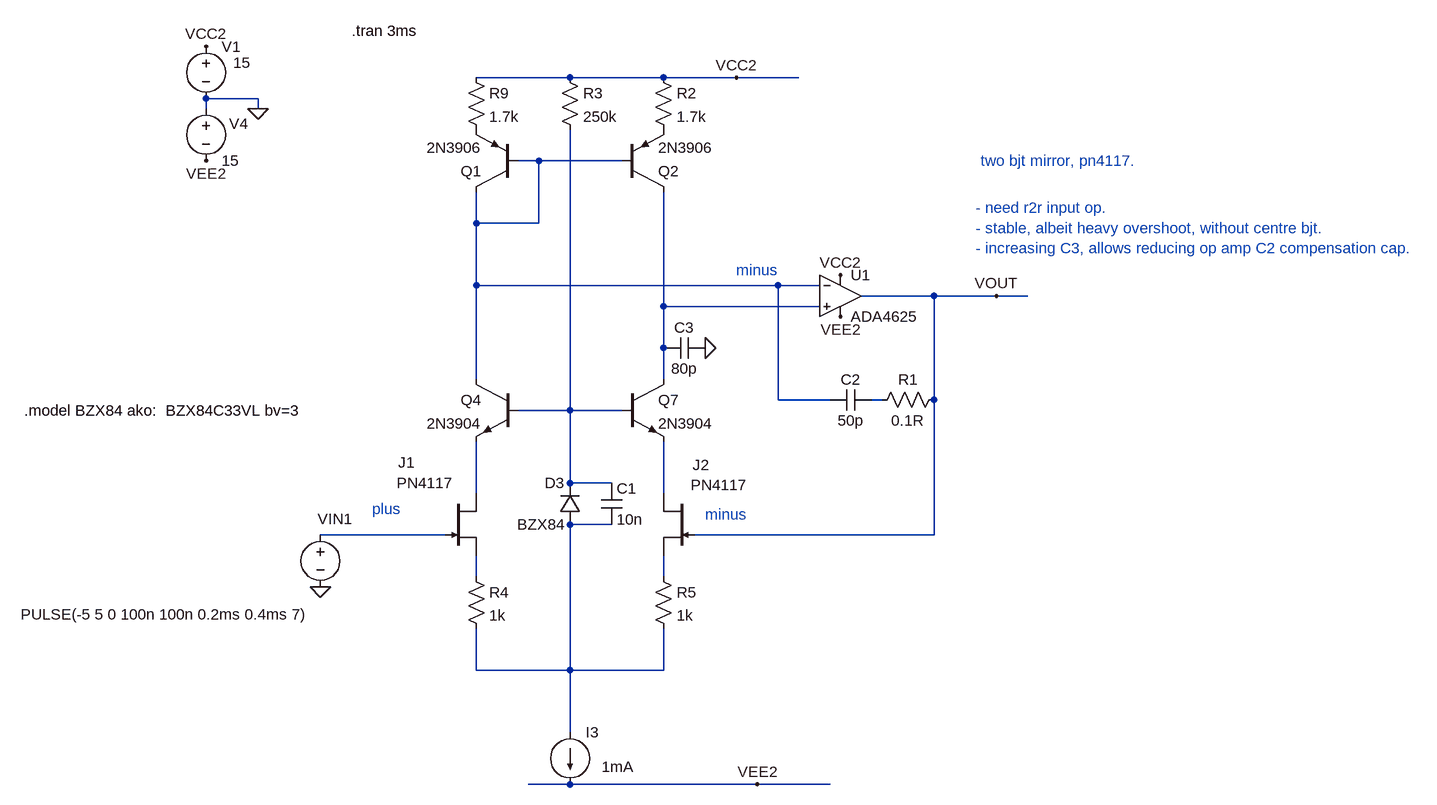
[diagram p0: schematic Draft49.asc]
Draft49.asc, the LTspice schematic file:
Version 4
SHEET 1 2428 952
WIRE 160 -320 16 -320
WIRE 304 -320 160 -320
WIRE 416 -320 304 -320
WIRE 512 -320 416 -320
WIRE -320 -288 -400 -288
WIRE -400 -272 -400 -288
WIRE -320 -272 -320 -288
WIRE 112 -192 80 -192
WIRE 240 -192 112 -192
WIRE 16 -96 16 -144
WIRE 112 -96 112 -192
WIRE 112 -96 16 -96
WIRE 16 0 16 -96
WIRE 480 0 16 0
WIRE 544 0 480 0
WIRE 720 16 608 16
WIRE 816 16 720 16
WIRE 864 16 816 16
WIRE 304 32 304 -144
WIRE 544 32 304 32
WIRE 304 96 304 32
WIRE 16 144 16 0
WIRE 304 144 304 96
WIRE 480 176 480 0
WIRE 560 176 480 176
WIRE 640 176 624 176
WIRE 720 176 720 16
WIRE 160 192 160 -240
WIRE 160 192 80 192
WIRE 240 192 160 192
WIRE 160 304 160 192
WIRE 224 304 160 304
WIRE 16 320 16 240
WIRE 304 320 304 240
WIRE 224 368 160 368
WIRE -32 384 -224 384
WIRE 720 384 720 176
WIRE 720 384 352 384
WIRE 16 448 16 416
WIRE 304 448 304 416
WIRE 16 592 16 528
WIRE 160 592 160 368
WIRE 160 592 16 592
WIRE 304 592 304 528
WIRE 304 592 160 592
WIRE 160 688 160 592
WIRE 160 768 96 768
WIRE 448 768 160 768
WIRE 560 768 448 768
FLAG -320 -272 0
FLAG -400 -368 VCC2
FLAG -400 -192 VEE2
FLAG 416 -320 VCC2
FLAG 448 768 VEE2
FLAG -224 464 0
FLAG 816 16 VOUT
FLAG 576 -16 VCC2
FLAG 576 48 VEE2
FLAG 368 96 0
SYMBOL voltage -400 -384 R0
WINDOW 123 0 0 Left 0
WINDOW 39 0 0 Left 0
WINDOW 3 42 41 Left 2
SYMATTR Value 15
SYMATTR InstName V1
SYMBOL voltage -400 -288 R0
WINDOW 123 0 0 Left 0
WINDOW 39 0 0 Left 0
WINDOW 0 36 39 Left 2
SYMATTR InstName V4
SYMATTR Value 15
SYMBOL voltage -224 368 R0
WINDOW 123 0 0 Left 0
WINDOW 39 0 0 Left 0
WINDOW 3 -461 138 Left 2
WINDOW 0 -4 -9 Left 2
SYMATTR Value PULSE(-5 5 0 100n 100n 0.2ms 0.4ms 7)
SYMATTR InstName VIN1
SYMBOL res 0 -336 R0
SYMATTR InstName R9
SYMATTR Value 1.7k
SYMBOL njf -32 320 R0
WINDOW 0 -72 -48 Left 2
WINDOW 3 -75 -16 Left 2
SYMATTR InstName J1
SYMATTR Value PN4117
SYMBOL njf 352 320 M0
WINDOW 0 3 -44 Right 2
WINDOW 3 6 -13 Right 2
SYMATTR InstName J2
SYMATTR Value PN4117
SYMBOL current 160 688 R0
WINDOW 123 0 0 Left 0
WINDOW 39 0 0 Left 0
WINDOW 3 49 53 Left 2
SYMATTR Value 1mA
SYMATTR InstName I3
SYMBOL res 288 -336 R0
SYMATTR InstName R2
SYMATTR Value 1.7k
SYMBOL npn 80 144 M0
SYMATTR InstName Q4
SYMATTR Value 2N3904
SYMBOL npn 240 144 R0
SYMATTR InstName Q7
SYMATTR Value 2N3904
SYMBOL diode 176 368 R180
WINDOW 0 24 64 Left 2
WINDOW 3 24 0 Left 2
SYMATTR InstName D3
SYMATTR Value BZX84
SYMBOL cap 208 304 R0
SYMATTR InstName C1
SYMATTR Value 10n
SYMBOL cap 624 160 R90
WINDOW 0 0 32 VBottom 2
WINDOW 3 32 32 VTop 2
SYMATTR InstName C2
SYMATTR Value 50p
SYMBOL res 736 160 R90
WINDOW 0 0 56 VBottom 2
WINDOW 3 32 56 VTop 2
SYMATTR InstName R1
SYMATTR Value 0.1R
SYMBOL res 144 -336 R0
SYMATTR InstName R3
SYMATTR Value 250k
SYMBOL pnp 80 -144 R180
SYMATTR InstName Q1
SYMATTR Value 2N3906
SYMBOL pnp 240 -144 M180
SYMATTR InstName Q2
SYMATTR Value 2N3906
SYMBOL res 0 432 R0
SYMATTR InstName R4
SYMATTR Value 1k
SYMBOL res 288 432 R0
SYMATTR InstName R5
SYMATTR Value 1k
SYMBOL cap 368 80 R90
WINDOW 0 0 32 VBottom 2
WINDOW 3 32 32 VTop 2
SYMATTR InstName C3
SYMATTR Value 80p
SYMBOL OpAmps\\ADA4625 576 -48 R0
SYMATTR InstName U1
TEXT -176 -392 Left 2 !.tran 3ms
TEXT 368 352 Left 2 ;minus
TEXT -144 344 Left 2 ;plus
TEXT -680 192 Left 2 !.model BZX84 ako:  BZX84C33VL bv=3
TEXT 416 -24 Left 2 ;minus
TEXT 784 -120 Left 2 ;- need r2r input op.\n- stable, albeit heavy overshoot, without centre bjt.\n- increasing C3, allows reducing op amp C2 compensation cap.
TEXT 792 -192 Left 2 ;two bjt mirror, pn4117.

The netlist it stands for:
* Draft49.asc
V1 VCC2 0 15
V4 0 VEE2 15
VIN1 N008 0 PULSE(-5 5 0 100n 100n 0.2ms 0.4ms 7)
R9 VCC2 P001 1.7k
J1 N005 N008 N009 PN4117
J2 N006 VOUT N010 PN4117
I3 N007 VEE2 1mA
R2 VCC2 P002 1.7k
Q4 N001 N004 N005 0 2N3904
Q7 N002 N004 N006 0 2N3904
D3 N007 N004 BZX84
C1 N004 N007 10n
C2 N003 N001 50p
R1 VOUT N003 0.1R
R3 VCC2 N004 250k
Q1 N001 N001 P001 0 2N3906
Q2 N002 N001 P002 0 2N3906
R4 N009 N007 1k
R5 N010 N007 1k
C3 0 N002 80p
XU1 N002 N001 VCC2 VEE2 VOUT ADA4625  ; pins In+ In- V+ V- OUT
.model D D
.lib standard.dio
.model NPN NPN
.model PNP PNP
.lib standard.bjt
.model NJF NJF
.model PJF PJF
.lib standard.jft
.tran 3ms
* minus
* plus
.model BZX84 ako:  BZX84C33VL bv=3
* minus
* - need r2r input op.
* - stable, albeit heavy overshoot, without centre bjt.
* - increasing C3, allows reducing op amp C2 compensation cap.
* two bjt mirror, pn4117.
.backanno
.end